# Altium schematic sheet 112J-TDAR-R01_SD1_112J-TDAR-R01_SD.schdoc
size 124 x 101 mm
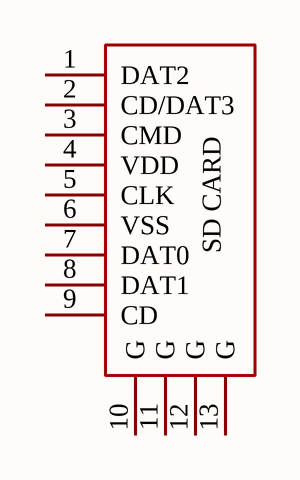
[diagram p0: 112J-TDAR-R01_SD1_112J-TDAR-R01_SD.schdoc]

## Parts
CON?  (no value)  [112J-T]

## Nets

Not connected (* = marked no-connect by the designer): CON? 1(DAT2) 2(CD/DAT3) 3(CMD) 4(VDD) 5(CLK) 6(VSS) 7(DAT0) 8(DAT1) 9(CD) 10(G) 11(G) 12(G) 13(G)

## Notes on the sheet
- (in symbol 112J-TDAR-R01_SD) SD CARD

## Library data of the parts
CON? = 112J-TDAR-R01_SD: Convert to PCB: yes; Symbol: 112J-TDAR-R01_SD; Device: 112J-TDAR-R01_SD; Add into BOM: yes